# Altium project NG_0036526167_Diplomski-rad.PrjPcb
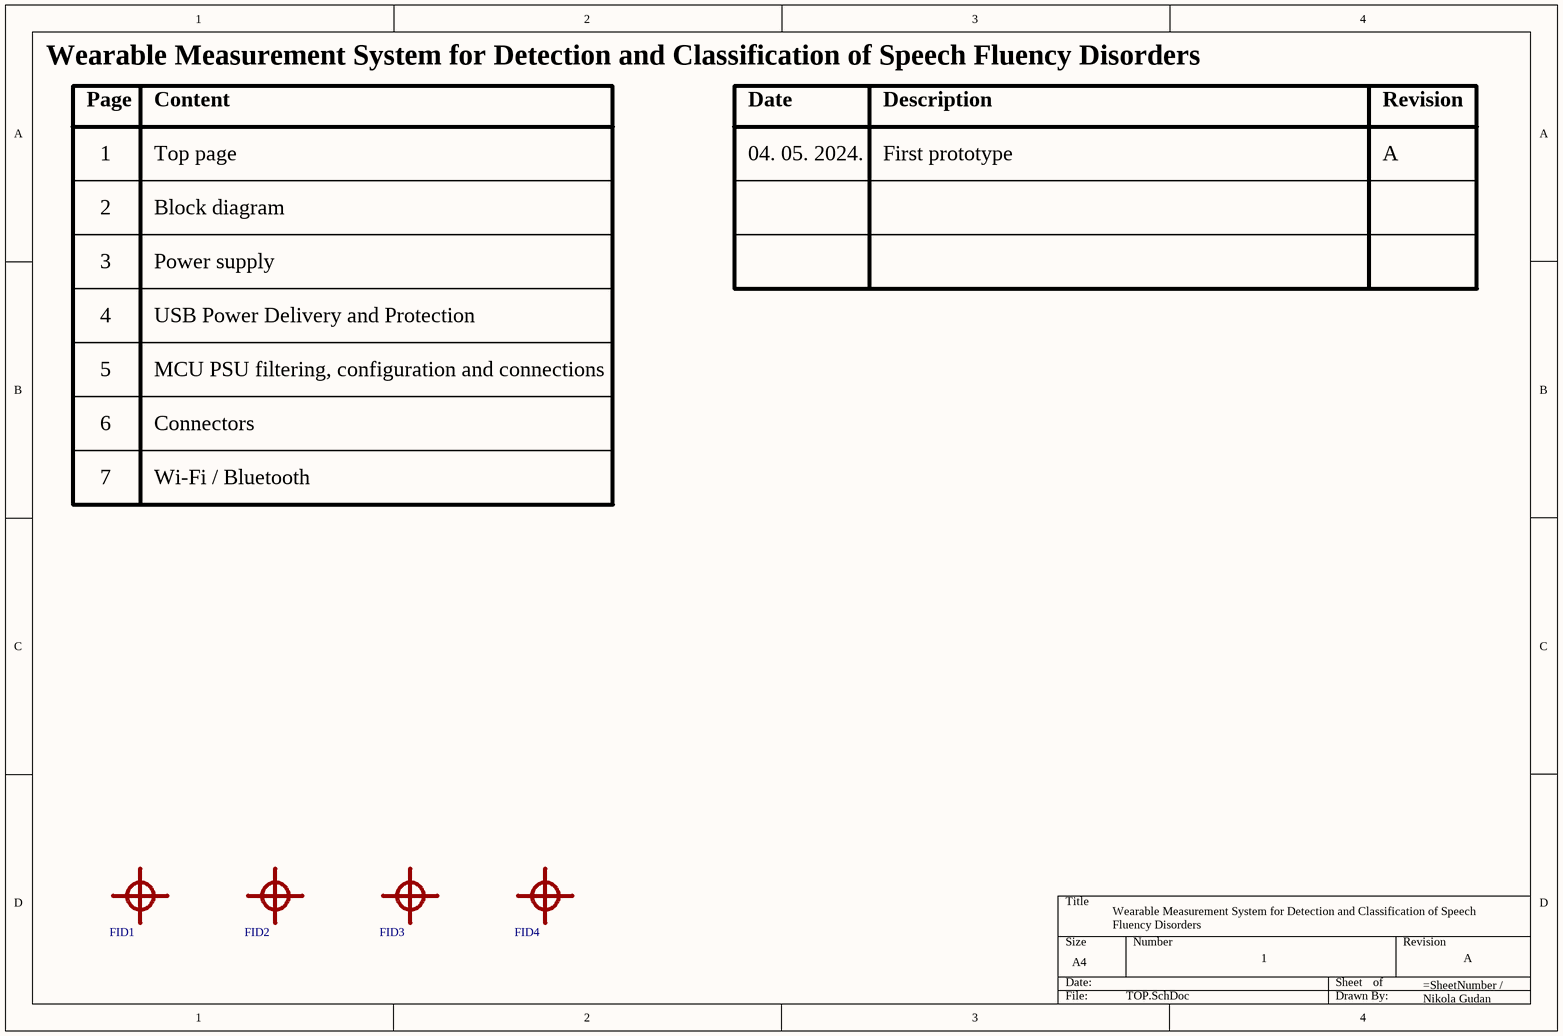
[diagram p0: TOP.SchDoc]
Engineer: Nikola Gudan; Revision: A; Title: Wearable Measurement System for Detection and Classification of Speech Fluency Disorders
7 sheets, 176 parts. Net scope: flat (ports and power ports of the same name join across sheets).
Board file: NG_0036526167_Diplomski-rad_PCB.PcbDoc
Sheets:
  TOP.SchDoc
  BLOCK-DIAGRAM.SchDoc
  POWER.SchDoc
  USB.SchDoc
  MCU.SchDoc
  CONN.SchDoc
  WIRELESS.SchDoc

## Sheet TOP.SchDoc: Wearable Measurement System for Detection and Classification of Speech Fluency Disorders
size A4; SheetNumber: 1; SheetTotal: 7

### Parts
FID1  FID  [FIDUCIAL]  (value not drawn)  (no BOM)
FID2  FID  [FIDUCIAL]  (value not drawn)  (no BOM)
FID3  FID  [FIDUCIAL]  (value not drawn)  (no BOM)
FID4  FID  [FIDUCIAL]  (value not drawn)  (no BOM)

### Notes on the sheet
- Page
- Content
- Date
- Description
- Revision
- 1
- Top page
- 04. 05. 2024.
- First prototype
- A
- 2
- Block diagram
- 3
- Power supply
- 4
- 5
- USB Power Delivery and Protection
- MCU PSU filtering, configuration and connections
- 6
- Connectors
- 7
- Wi-Fi / Bluetooth

### Library data of the parts
FID1-FID4 = FIDUCIAL: Fiducial marker; Checked: Yes; Footprint: ?; MFR: ?; Supplier: Digi-Key; SPN: ?; MFRN: ?

## Sheet BLOCK-DIAGRAM.SchDoc: Wearable Measurement System for Detection and Classification of Speech Fluency Disorders
size A4; SheetNumber: 2; SheetTotal: 7
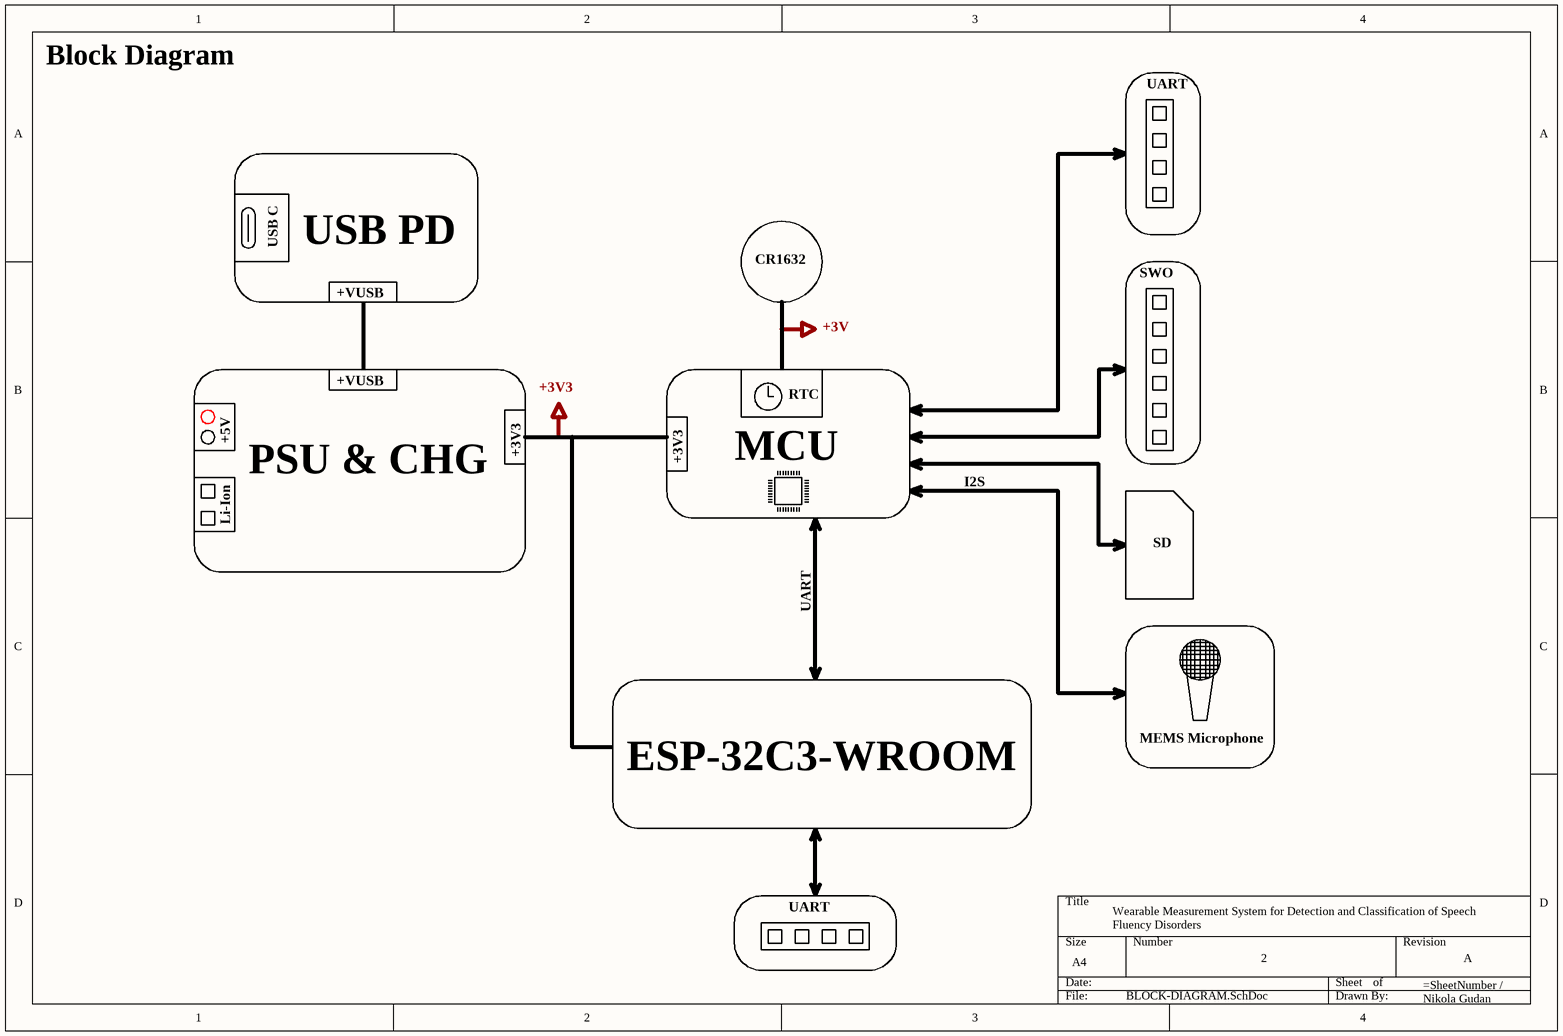
[diagram p1: BLOCK-DIAGRAM.SchDoc]

### Notes on the sheet
- Block Diagram
- UART
- USB C
- USB PD
- +VUSB
- CR1632
- SWO
- +3V
- +5V
- +3V3
- RTC
- Li-Ion
- PSU & CHG
- MCU
- I2S
- SD
- ESP-32C3-WROOM
- MEMS Microphone

## Sheet POWER.SchDoc: Wearable Measurement System for Detection and Classification of Speech Fluency Disorders
size A4; SheetNumber: 3; SheetTotal: 7
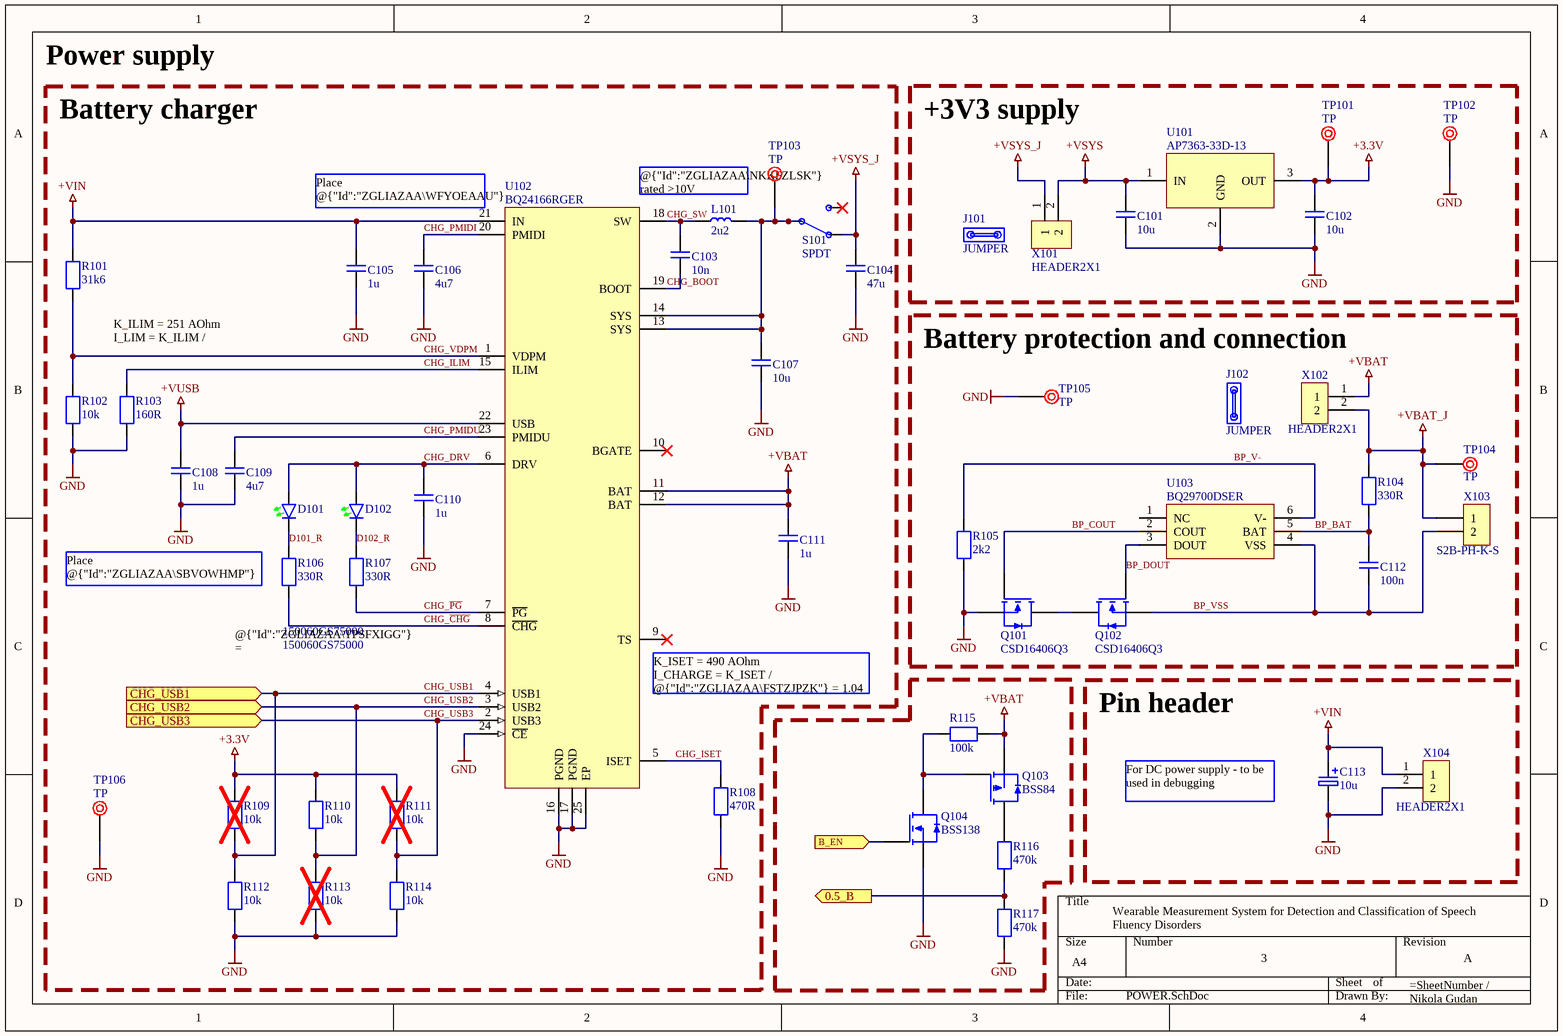
[diagram p2: POWER.SchDoc]

### Parts
C101  10u  [CAPC0603]
C102  10u  [CAPC0603]
C103  10n  [CAPC0603]
C104  47u  [CAPC0805]
C105  1u  [CAPC0603]
C106  4u7  [CAPC0603]
C107  10u  [CAPC0603]
C108  1u  [CAPC0603]
C109  4u7  [CAPC0603]
C110  1u  [CAPC0603]
C111  1u  [CAPC0603]
C112  100n  [CAPC0603]
C113  10u  [CAPCP1206]
D101  150060GS75000  [LED0603]
D102  150060GS75000  [LED0603]
J101  JUMPER  (mechanical)
J102  JUMPER  (mechanical)
L101  2u2  [INDM4145X18]
Q101  CSD16406Q3  [TRANS_CSD16406Q3]
Q102  CSD16406Q3  [TRANS_CSD16406Q3]
Q103  BSS84  [SOT190P240X290-3]
Q104  BSS138  [SOT190P240X290-3]
R101  31k6  [RESC0603]
R102  10k  [RESC0603]
R103  160R  [RESC0603]
R104  330R  [RESC0603]
R105  2k2  [RESC0603]
R106  330R  [RESC0603]
R107  330R  [RESC0603]
R108  470R  [RESC0603]
R109  10k  [RESC0603]
R110  10k  [RESC0603]
R111  10k  [RESC0603]
R112  10k  [RESC0603]
R113  10k  [RESC0603]
R114  10k  [RESC0603]
R115  100k  [RESC0603]
R116  470k  [RESC0603]
R117  470k  [RESC0603]
S101  SPDT  [SW_EG1247]
TP101  TP  [TESTPOINT]
TP102  TP  [TESTPOINT]
TP103  TP  [TESTPOINT]
TP104  TP  [TESTPOINT]
TP105  TP  [TESTPOINT]
TP106  TP  [TESTPOINT]
U101  AP7363-33D-13  [TO457X991X229-3]
U102  BQ24166RGER  [QFN50P410X410X100-24EP]
U103  BQ29700DSER  [WSON50P150X150X80-6]
X101  HEADER2X1  [HDRV2W64P254_2X1_508X254X1150]
X102  HEADER2X1  [HDRV2W64P254_2X1_508X254X1150]
X103  S2B-PH-K-S  [JST_S2B-PH-K-S]
X104  HEADER2X1  [HDRV2W64P254_2X1_508X254X1150]

### Blocks framed on the sheet
+3V3 supply: C101 C102 J101 TP101 TP102 U101 X101
Battery protection and connection: C112 J102 Q101 Q102 R104 R105 TP104 TP105 U103 X102 X103
Pin header: C113 X104

### Ports
0.5_B (out, see MCU[1B]), B_EN (in, see MCU[1B]), CHG_USB1 (in, see MCU[2B]), CHG_USB2 (in, see MCU[2B]), CHG_USB3 (in, see MCU[2B])

### Nets
+3.3V: C102.2 R109.1 R110.1 R111.1 TP101.1 U101.3(OUT)
+VBAT: C111.2 Q103.2(S) R115.1 U102.11(BAT) U102.12(BAT) X102.1
+VBAT_J: R104.2 TP104.1 X102.2 X103.1
+VIN: C105.2 C113.1 R101.2 U102.21(IN) X104.1
+VSYS: C101.2 U101.1(IN) X101.2
+VSYS_J: C104.2 S101.1 X101.1
+VUSB: C108.2 U102.22(USB)
GND: C101.1 C102.1 C104.1 C105.1 C106.1 C107.1 C108.1 C109.1 C110.1 C111.1 C113.2 Q101.1(S) Q104.2(S) R102.2 R103.2 R105.1 R108.1 R112.2 R113.2 R114.2 R117.2 TP102.1 TP105.1 TP106.1 U101.2(GND) U102.16(PGND) U102.17(PGND) U102.24(~{CE}) U102.25(EP) X104.2
0.5_B: R116.2 R117.1 ; port 0.5_B
B_EN: Q104.1(G) ; port B_EN
BP_BAT: C112.2 R104.1 U103.5(BAT)
BP_COUT: Q101.3(G) U103.2(COUT)
BP_DOUT: Q102.3(G) U103.3(DOUT)
BP_V-: R105.2 U103.6(V-)
BP_VSS: C112.1 Q102.1(S) U103.4(VSS) X103.2
CHG_BOOT: C103.1 U102.19(BOOT)
CHG_~{CHG}: R106.1 U102.8(~{CHG})
CHG_DRV: C110.2 D101.2 D102.2 U102.6(DRV)
CHG_ILIM: R103.1 U102.15(ILIM)
CHG_ISET: R108.2 U102.5(ISET)
CHG_~{PG}: R107.1 U102.7(~{PG})
CHG_PMIDI: C106.2 U102.20(PMIDI)
CHG_PMIDU: C109.2 U102.23(PMIDU)
CHG_SW: C103.2 L101.1 U102.18(SW)
CHG_USB1: R109.2 R112.1 U102.4(USB1) ; port CHG_USB1
CHG_USB2: R110.2 R113.1 U102.3(USB2) ; port CHG_USB2
CHG_USB3: R111.2 R114.1 U102.2(USB3) ; port CHG_USB3
CHG_VDPM: R101.1 R102.1 U102.1(VDPM)
D101_R: D101.1 R106.2
D102_R: D102.1 R107.2
NetC107_2: C107.2 L101.2 S101.2 TP103.1 U102.13(SYS) U102.14(SYS)
NetQ101_2: Q101.2(D) Q102.2(D)
NetQ103_1: Q103.1(G) Q104.3(D) R115.2
NetQ103_3: Q103.3(D) R116.1

Not connected (* = marked no-connect by the designer): S101 3*; U102 9(TS)* 10(BGATE)*; U103 1(NC)

### Notes on the sheet
- Power supply
- Battery charger
- (near U102) Place @{"Id":"ZGLIAZAA\WFYOEAAU"} and @{"Id":"ZGLIAZAA\EWRWHMYO"} as close as possible to charger IC
- @{"Id":"ZGLIAZAA\NKKFZLSK"} rated >10V
- K_ILIM = 251 AOhm
  I_LIM = K_ILIM / @{"Id":"ZGLIAZAA\ONCUCXZC"} = 1.57 A
- Place @{"Id":"ZGLIAZAA\SBVOWHMP"} and @{"Id":"ZGLIAZAA\CELJBMPW"} as close as possible to charger IC
- @{"Id":"ZGLIAZAA\TPSFXIGG"} =
  @{"Id":"ZGLIAZAA\WLQFVBKC"} =
- (near U102) K_ISET = 490 AOhm
  I_CHARGE = K_ISET / @{"Id":"ZGLIAZAA\FSTZJPZK"} = 1.04 A
- For DC power supply - to be used in debugging

### Library data of the parts
C101-C103 C105-C112 = CAPC0603: Ceramic capacitor, VAL?,  VOL?, DIEL?; Checked: Yes; MFR: ?; Supplier: Digi-Key; SPN: ?; MFRN: ?; LCSC Part Number: ?
  C101 C102 C107: Value: 10u
  C103: Value: 10n
  C105 C108 C110 C111: Value: 1u
  C106 C109: Value: 4u7
  C112: Value: 100n
C104 = CAPC0805: Ceramic capacitor, VAL?,  VOL?, DIEL?; Checked: Yes; Footprint: 0805; MFR: ?; Supplier: Mouser; SPN: ?; MFRN: ?; Value: 47u; LCSC Part Number: ?
C113 = CAPCP1206-10u-10: Tantalum capacitor, 10uF,  10V, 3.8Ohm; MFR: KEMET; MFRN: T491A106K010AT; SPN: 399-3684-2-ND; Checked: Yes; Supplier: Digi-Key; Value: 10u; LCSC Part Number: C1508940
D101 D102 = LTST-C194KGKT: LED Green, 2.1V, 20mA; MFR: Würth Elektronik; SPN: 732-4971-2-ND; Checked: Yes; Supplier: Digi-Key; MFRN: 150060GS75000; Value: Green; LCSC Part Number: C913102
J101 J102 = JUMPER: Open Top 3A 2.54mm P=2.54mm Shunts & Jumpers ROHS; MFR: Kycon, Inc.; MFRN: SX1100-A; SPN: 2092-SX1100-A-ND; Value: C5305; Checked: Yes; Supplier: Digi-Key; LCSC Part Number: C5305
L101 = INDM4145-2u2-20: Inductor 2.2uH, 4A, ±20%, 61mOhm; MFR: Bourns Inc.; MFRN: SRP4020TA-2R2M; SPN: SRP4020TA-2R2MTR-ND; Checked: Yes; Supplier: Digi-Key; Value: 2.2uH; LCSC Part Number: C2847469
Q101 Q102 = CSD16406Q3: MOSFET N-CH 25V 60A 8VSON; MFR: Texas Instruments; SPN: 296-24251-2-ND; Checked: Yes; Supplier: Digi-Key; MFRN: CSD16406Q3; Value: CSD16406Q3; LCSC Part Number: C2861720
Q103 = BSS84: MOSFET P-CH 50V 130mA SOT23-3; MFR: onsemi; SPN: BSS84TR-ND; Checked: Yes; Supplier: Digi-Key; MFRN: BSS84; Value: BSS84; LCSC Part Number: C266796
Q104 = BSS138: MOSFET N-CH 50V 220mA SOT23-3; MFR: onsemi; SPN: BSS138TR-ND; Checked: Yes; Supplier: Digi-Key; MFRN: BSS138; Value: BSS138; LCSC Part Number: C52895
R101-R117 = RES0603: Thick film resistor, VAL?, POW?; Checked: Yes; MFR: ?; Supplier: Digi-Key; SPN: ?; MFRN: ?; LCSC Part Number: ?
  R101: Value: 31k6
  R102 R109-R114: Value: 10k
  R103: Value: 160R
  R104 R106 R107: Value: 330R
  R105: Value: 2k2
  R108: Value: 470R
  R115: Value: 100k
  R116 R117: Value: 470k
S101 = SLIDE SW SPDT: Slide switch, SPDT, 30V, 200mA; MFR: E-Switch; MFRN: EG1247; SPN: EG1247-ND; Value: EG1247; Checked: Yes; Supplier: Digi-Key
TP101-TP106 = TESTPOINT: MFR: Keystone; MFRN: 5001; SPN: 36-5001-ND; Value: 5001; Checked: Yes; Supplier: Digi-Key; LCSC Part Number: C238122
U101 = IC REG LINEAR AP7363-33D-13: Linear LDO Voltage Regulator, 3.3V, 1.5A; MFR: Diodes Incorporated; SPN: AP7363-33D-13TR-ND; Checked: Yes; Supplier: Digi-Key; MFRN: AP7363-33D-13; Value: AP7363-33D-13; LCSC Part Number: C108723
U102 = IC BATT CHG LI-ION BQ24166: IC Battery Charger, Li-Ion, 1 Cell, 3.7V, 2.5A; MFR: Texas Instruments; SPN: 296-48490-2-ND; Checked: Yes; Supplier: Digi-Key; MFRN: BQ24166RGER; Value: BQ24166RGER; LCSC Part Number: C2758608
U103 = IC BATT PROT BQ29700DSER: Battery Protection IC Li-Ion 1Cell; MFR: Texas Instruments; SPN: 296-43985-2-ND; Checked: Yes; Supplier: Digi-Key; MFRN: BQ29700DSER; Value: BQ29700DSER; LCSC Part Number: C183096
X101 X102 = HEADER2X1: Pin Header 2x1, P2.54; MFR: Adam Tech; MFRN: PH1-02-UA; SPN: 2057-PH1-02-UA-ND; Value: X6521WV-2x01H-C60D30; Checked: Yes; Supplier: Digi-Key; LCSC Part Number: C2883961
X103 = JST S2B-PH-K-S: JST PH Connector 2POS R/A THT; MFR: JST Sales America Inc.; SPN: 455-1719-ND; Checked: Yes; Supplier: Digi-Key; MFRN: S2B-PH-K-S; Value: S2B-PH-K-S; LCSC Part Number: C173752
X104 = HEADER2X1: Pin Header 2x1, P2.54; MFR: Adam Tech; MFRN: PH1-02-UA; SPN: 2057-PH1-02-UA-ND; Checked: Yes; Supplier: Digi-Key; Value: HEADER2X1; LCSC Part Number: C2883961

## Sheet USB.SchDoc: Wearable Measurement System for Detection and Classification of Speech Fluency Disorders
size A4; SheetNumber: 4; SheetTotal: 7
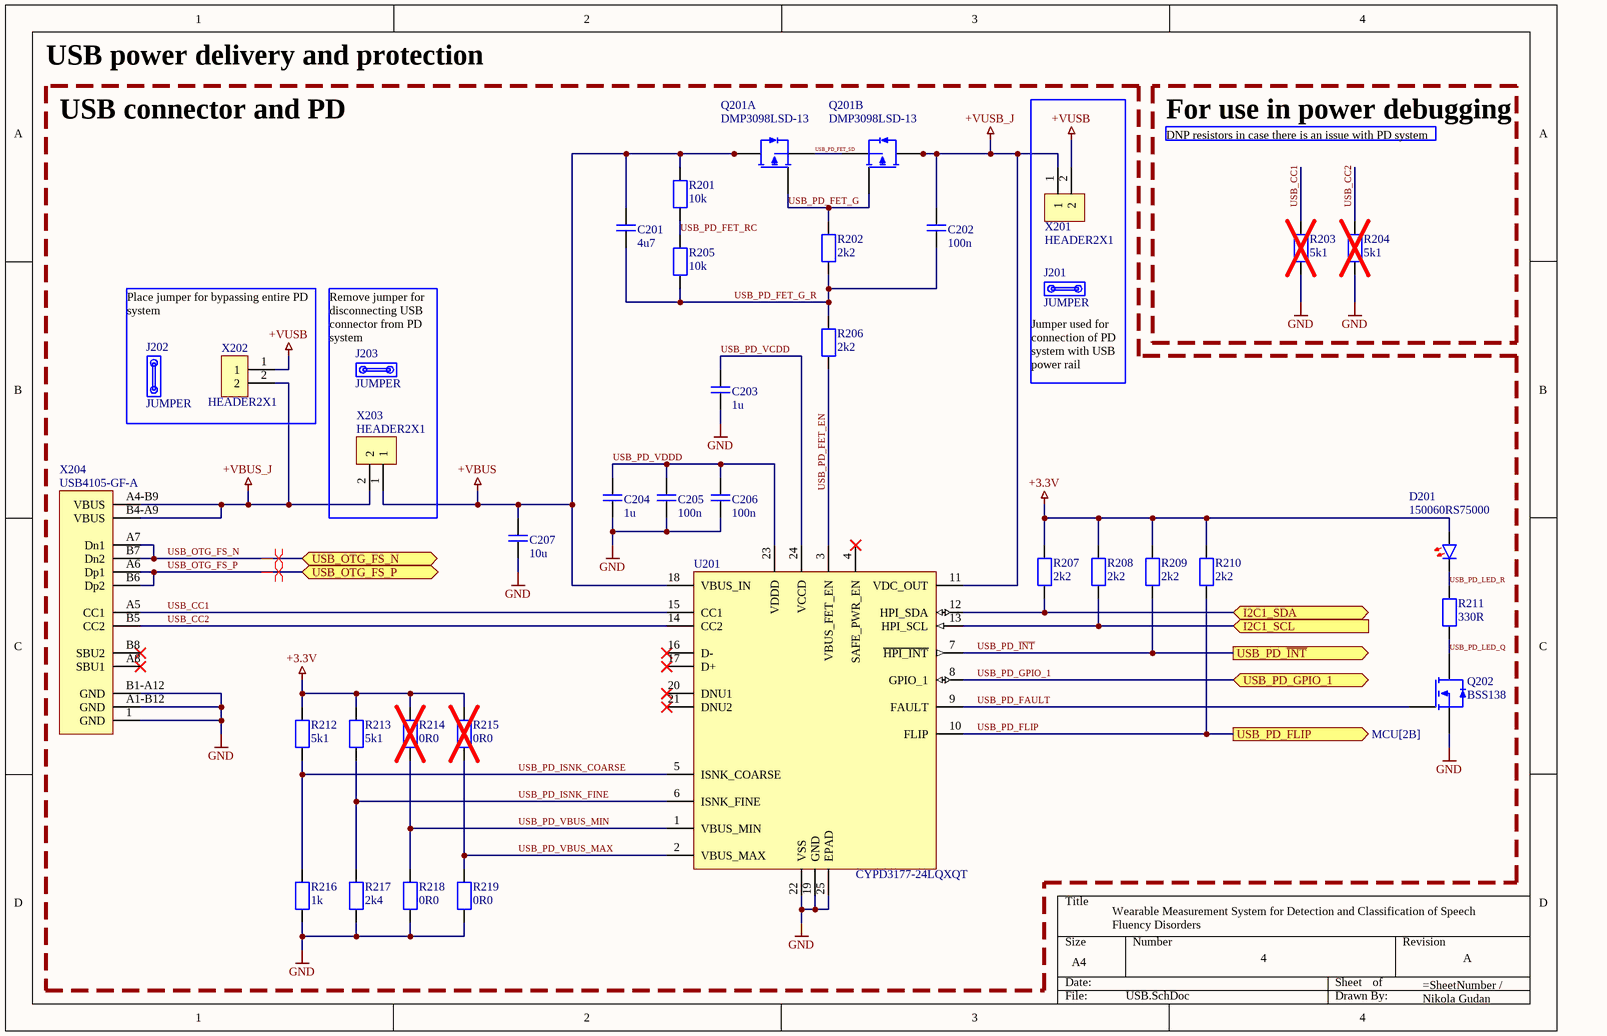
[diagram p3: USB.SchDoc]

### Parts
C201  4u7  [CAPC0603]
C202  100n  [CAPC0603]
C203  1u  [CAPC0603]
C204  1u  [CAPC0603]
C205  100n  [CAPC0603]
C206  100n  [CAPC0603]
C207  10u  [CAPC0603]
D201  150060RS75000  [LED0603]
J201  JUMPER  (mechanical)
J202  JUMPER  (mechanical)
J203  JUMPER  (mechanical)
Q201  DMP3098LSD-13  [SOIC127P620X175-8]  (parts A,B of 2)
Q202  BSS138  [SOT190P240X290-3]
R201  10k  [RESC0603]
R202  2k2  [RESC0603]
R203  5k1  [RESC0603]
R204  5k1  [RESC0603]
R205  10k  [RESC0603]
R206  2k2  [RESC0603]
R207  2k2  [RESC0603]
R208  2k2  [RESC0603]
R209  2k2  [RESC0603]
R210  2k2  [RESC0603]
R211  330R  [RESC0603]
R212  5k1  [RESC0603]
R213  5k1  [RESC0603]
R214  0R0  [RESC0603]
R215  0R0  [RESC0603]
R216  1k  [RESC0603]
R217  2k4  [RESC0603]
R218  0R0  [RESC0603]
R219  0R0  [RESC0603]
U201  CYPD3177-24LQXQT  [QFN50P410X410X100-24EP]
X201  HEADER2X1  [HDRV2W64P254_2X1_508X254X1150]
X202  HEADER2X1  [HDRV2W64P254_2X1_508X254X1150]
X203  HEADER2X1  [HDRV2W64P254_2X1_508X254X1150]
X204  USB4105-GF-A  [GCT_USB4105-GF-A]

### Blocks framed on the sheet
For use in power debugging: R203 R204

### Ports
I2C1_SCL (in, see MCU[1B]), I2C1_SDA (bidir, see MCU[1B]), USB_OTG_FS_N (bidir, see MCU[1B]), USB_OTG_FS_P (bidir, see MCU[1B]), USB_PD_FLIP (out, see MCU[2B]), USB_PD_GPIO_1 (bidir, see MCU[2B]), USB_PD_~{INT} (out, see MCU[2B])

### Nets
+3.3V: D201.2 R207.2 R208.2 R209.2 R210.2 R212.2 R213.2 R214.2 R215.2
+VBUS: C201.2 C207.2 Q201.7(D1) Q201.8(D1) R201.2 U201.18(VBUS_IN) X203.1
+VBUS_J: X202.2 X203.2 X204.A4-B9(VBUS) X204.B4-A9(VBUS)
+VUSB: X201.2 X202.1
+VUSB_J: C202.2 Q201.5(D2) Q201.6(D2) U201.11(VDC_OUT) X201.1
GND: C203.1 C204.1 C205.1 C206.1 C207.1 Q202.2(S) R203.1 R204.1 R216.1 R217.1 R218.1 R219.1 U201.19(GND) U201.22(VSS) U201.25(EPAD) X204.1(GND) X204.A1-B12(GND) X204.B1-A12(GND)
I2C1_SCL: R208.1 U201.13(HPI_SCL) ; port I2C1_SCL
I2C1_SDA: R207.1 U201.12(HPI_SDA) ; port I2C1_SDA
USB_CC1: R203.2 U201.15(CC1) X204.A5(CC1)
USB_CC2: R204.2 U201.14(CC2) X204.B5(CC2)
USB_OTG_FS_N: X204.A7(Dn1) X204.B7(Dn2) ; port USB_OTG_FS_N
USB_OTG_FS_P: X204.A6(Dp1) X204.B6(Dp2) ; port USB_OTG_FS_P
USB_PD_FAULT: Q202.1(G) U201.9(FAULT)
USB_PD_FET_EN: R206.1 U201.3(VBUS_FET_EN)
USB_PD_FET_G: Q201.2(G1) Q201.4(G2) R202.2
USB_PD_FET_G_R: C201.1 C202.1 R202.1 R205.1 R206.2
USB_PD_FET_RC: R201.1 R205.2
USB_PD_FET_SD: Q201.1(S1) Q201.3(S2)
USB_PD_FLIP: R210.1 U201.10(FLIP) ; port USB_PD_FLIP
USB_PD_GPIO_1: U201.8(GPIO_1) ; port USB_PD_GPIO_1
USB_PD_~{INT}: R209.1 U201.7(~{HPI_INT}) ; port USB_PD_~{INT}
USB_PD_ISNK_COARSE: R212.1 R216.2 U201.5(ISNK_COARSE)
USB_PD_ISNK_FINE: R213.1 R217.2 U201.6(ISNK_FINE)
USB_PD_LED_Q: Q202.3(D) R211.1
USB_PD_LED_R: D201.1 R211.2
USB_PD_VBUS_MAX: R215.1 R219.2 U201.2(VBUS_MAX)
USB_PD_VBUS_MIN: R214.1 R218.2 U201.1(VBUS_MIN)
USB_PD_VCDD: C203.2 U201.24(VCCD)
USB_PD_VDDD: C204.2 C205.2 C206.2 U201.23(VDDD)

Not connected (* = marked no-connect by the designer): U201 4(SAFE_PWR_EN)* 16(D-)* 17(D+)* 20(DNU1)* 21(DNU2)*; X204 A8(SBU1)* B8(SBU2)*

### Layout directives
differential pair: USB_OTG_FS_N, USB_OTG_FS_P

### Notes on the sheet
- USB power delivery and protection
- USB connector and PD
- DNP resistors in case there is an issue with PD system
- Jumper used for connection of PD system with USB power rail
- Place jumper for bypassing entire PD system
- Remove jumper for disconnecting USB connector from PD system

### Library data of the parts
C201-C207 = CAPC0603: as C101 on sheet POWER; MFR: ?; Supplier: Digi-Key; SPN: ?; MFRN: ?; LCSC Part Number: ?
  C201: Value: 4u7
  C202 C205 C206: Value: 100n
  C203 C204: Value: 1u
  C207: Value: 10u
D201 = HL-PST-1608S9AC-04: LED Red, 2.3V, 20mA; MFR: Würth Elektronik; SPN: 732-4978-2-ND; Checked: Yes; Supplier: Digi-Key; MFRN: 150060RS75000; Value: RED; LCSC Part Number: C497931
J201-J203 = JUMPER: as J101 on sheet POWER; Supplier: Digi-Key; LCSC Part Number: C5305
Q201 = DMP3098LSD-13: MOSFET 2P-CH 30V 4.4A 8-SOIC; MFR: Diodes Incorporated; SPN: DMP3098LSD-13DITR-ND; Checked: Yes; Supplier: Digi-Key; MFRN: DMP3098LSD-13; Value: DMP3098LSD-13; LCSC Part Number: C531177
Q202 = BSS138: MOSFET N-CH 50V 220MA SOT23-3; MFR: onsemi; SPN: BSS138TR-ND; Checked: Yes; Supplier: Digi-Key; MFRN: BSS138; Value: BSS138; LCSC Part Number: C52895
R201-R219 = RES0603: as R101 on sheet POWER; MFR: ?; Supplier: Digi-Key; SPN: ?; MFRN: ?; LCSC Part Number: ?
  R201 R205: Value: 10k
  R202 R206-R210: Value: 2k2
  R203 R204 R212 R213: Value: 5k1
  R211: Value: 330R
  R214 R215 R218 R219: Value: 0R0
  R216: Value: 1k
  R217: Value: 2k4
U201 = CYPD3177-24LQXQT: Generic Description; MFR: Infineon Technologies; SPN: 448-CYPD3177-24LQXQTTR-ND; Checked: Yes; Supplier: Digi-Key; MFRN: CYPD3177-24LQXQT; Value: CYPD3177-24LQXQT; LCSC Part Number: C5904158
X201 X202 = HEADER2X1: as X101 on sheet POWER; Supplier: Digi-Key; LCSC Part Number: C2883961
X203 = HEADER2X1: as X104 on sheet POWER; Supplier: Digi-Key; Value: HEADER2X1; LCSC Part Number: C2883961
X204 = CONN USB 2.0 TYPE C: USB TYPE-C 3.1, 3A; MFR: GCT; SPN: 2073-USB4105-GF-ATR-ND; Checked: Yes; Supplier: Digi-Key; MFRN: USB4105-GF-A; Value: USB4105-GF-A; LCSC Part Number: C2997433

## Sheet MCU.SchDoc: Wearable Measurement System for Detection and Classification of Speech Fluency Disorders
size A4; SheetNumber: 5; SheetTotal: 7
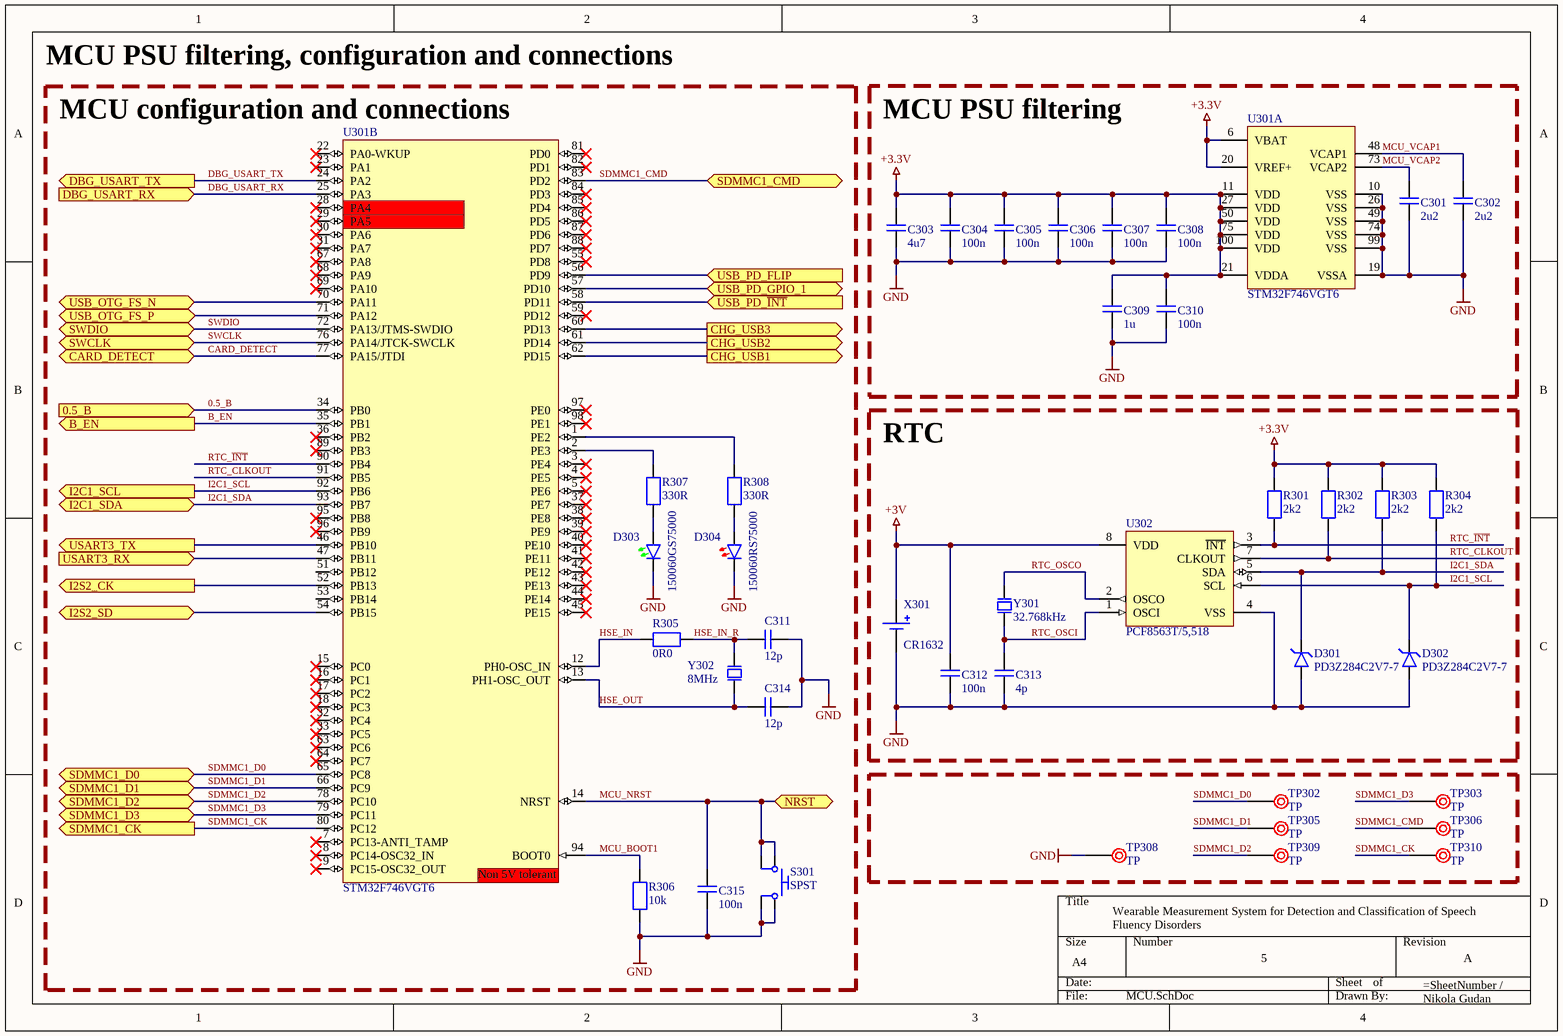
[diagram p4: MCU.SchDoc]

### Parts
C301  2u2  [CAPC0603]
C302  2u2  [CAPC0603]
C303  4u7  [CAPC0603]
C304  100n  [CAPC0603]
C305  100n  [CAPC0603]
C306  100n  [CAPC0603]
C307  100n  [CAPC0603]
C308  100n  [CAPC0603]
C309  1u  [CAPC0603]
C310  100n  [CAPC0603]
C311  12p  [CAPC0603]
C312  100n  [CAPC0603]
C313  4p  [CAPC0603]
C314  12p  [CAPC0603]
C315  100n  [CAPC0603]
D301  PD3Z284C2V7-7  [PowerDI323]
D302  PD3Z284C2V7-7  [PowerDI323]
D303  150060GS75000  [LED0603]
D304  150060RS75000  [LED0603]
R301  2k2  [RESC0603]
R302  2k2  [RESC0603]
R303  2k2  [RESC0603]
R304  2k2  [RESC0603]
R305  0R0  [RESC0603]
R306  10k  [RESC0603]
R307  330R  [RESC0603]
R308  330R  [RESC0603]
S301  SPST  [SW_TSA063G60-250]
TP302  TP  [TESTPOINT]
TP303  TP  [TESTPOINT]
TP305  TP  [TESTPOINT]
TP306  TP  [TESTPOINT]
TP308  TP  [TESTPOINT]
TP309  TP  [TESTPOINT]
TP310  TP  [TESTPOINT]
U301  STM32F746VGT6  [QFP50P1600X1600X160-100]  (parts A,B of 2)
U302  PCF8563T/5,518  [SOIC127P610X175-8]
X301  CR1632  [BAT_504TR]
Y301  32.768kHz  [XTAL320X150X80]
Y302  8MHz  [XTAL800X450X180]

### Blocks framed on the sheet
MCU PSU filtering: C301-C310 U301
RTC: C312 C313 D301 D302 R301-R304 U302 X301 Y301

### Ports
0.5_B (in, see POWER[3D]), B_EN (out, see POWER[3D]), CARD_DETECT (bidir, see CONN[3B]), CHG_USB1 (out, see POWER[1C]), CHG_USB2 (out, see POWER[1C]), CHG_USB3 (out, see POWER[1C]), DBG_USART_RX (in, see CONN[4B]), DBG_USART_TX (out, see CONN[4B]), I2C1_SCL (out, see USB[4C]), I2C1_SDA (bidir, see USB[4C]), I2S2_CK (out, see CONN[1C]), I2S2_SD (bidir, see CONN[1C]), NRST (bidir, see CONN[4A], WIRELESS[1B]), SDMMC1_CK (out, see CONN[3B]), SDMMC1_CMD (bidir, see CONN[3B]), SDMMC1_D0 (bidir, see CONN[3B]), SDMMC1_D1 (bidir, see CONN[3B]), SDMMC1_D2 (bidir, see CONN[3B]), SDMMC1_D3 (bidir, see CONN[3B]), SWCLK (bidir, see CONN[4A]), SWDIO (bidir, see CONN[4A]), USART3_RX (in, see WIRELESS[2B]), USART3_TX (out, see WIRELESS[2B]), USB_OTG_FS_N (bidir, see USB[1C]), USB_OTG_FS_P (bidir, see USB[1C]), USB_PD_FLIP (in, see USB[4C]), USB_PD_GPIO_1 (bidir, see USB[4C]), USB_PD_~{INT} (in, see USB[4C])

### Nets
+3.3V: C303.2 C304.2 C305.2 C306.2 C307.2 C308.2 C309.2 C310.2 R301.2 R302.2 R303.2 R304.2 U301.6(VBAT) U301.11(VDD) U301.20(VREF+) U301.21(VDDA) U301.27(VDD) U301.50(VDD) U301.75(VDD) U301.100(VDD)
+3V: C312.2 U302.8(VDD) X301.1(P)
GND: C301.1 C302.1 C303.1 C304.1 C305.1 C306.1 C307.1 C308.1 C309.1 C310.1 C311.2 C312.1 C313.1 C314.2 C315.1 D301.2 D302.2 D303.1 D304.1 R306.1 S301.3 S301.4 TP308.1 U301.10(VSS) U301.19(VSSA) U301.26(VSS) U301.49(VSS) U301.74(VSS) U301.99(VSS) U302.4(VSS) X301.2(N)
0.5_B: U301.34(PB0) ; port 0.5_B
B_EN: U301.35(PB1) ; port B_EN
CARD_DETECT: U301.77(PA15/JTDI) ; port CARD_DETECT
CHG_USB1: U301.62(PD15) ; port CHG_USB1
CHG_USB2: U301.61(PD14) ; port CHG_USB2
CHG_USB3: U301.60(PD13) ; port CHG_USB3
DBG_USART_RX: U301.25(PA3) ; port DBG_USART_RX
DBG_USART_TX: U301.24(PA2) ; port DBG_USART_TX
HSE_IN: R305.2 U301.12(PH0-OSC_IN)
HSE_IN_R: C311.1 R305.1 Y302.2
HSE_OUT: C314.1 U301.13(PH1-OSC_OUT) Y302.1
I2C1_SCL: D302.1 R304.1 U301.92(PB6) U302.6(SCL) ; port I2C1_SCL
I2C1_SDA: D301.1 R303.1 U301.93(PB7) U302.5(SDA) ; port I2C1_SDA
I2S2_CK: U301.52(PB13) ; port I2S2_CK
I2S2_SD: U301.54(PB15) ; port I2S2_SD
MCU_BOOT1: R306.2 U301.94(BOOT0)
MCU_NRST: C315.2 S301.1 S301.2 U301.14(NRST) ; port NRST
MCU_VCAP1: C302.2 U301.48(VCAP1)
MCU_VCAP2: C301.2 U301.73(VCAP2)
RTC_CLKOUT: R302.1 U301.91(PB5) U302.7(CLKOUT)
RTC_~{INT}: R301.1 U301.90(PB4) U302.3(~{INT})
RTC_OSCI: C313.2 U302.1(OSCI) Y301.1
RTC_OSCO: U302.2(OSCO) Y301.2
SDMMC1_CK: TP310.1 U301.80(PC12) ; port SDMMC1_CK
SDMMC1_CMD: TP306.1 U301.83(PD2) ; port SDMMC1_CMD
SDMMC1_D0: TP302.1 U301.65(PC8) ; port SDMMC1_D0
SDMMC1_D1: TP305.1 U301.66(PC9) ; port SDMMC1_D1
SDMMC1_D2: TP309.1 U301.78(PC10) ; port SDMMC1_D2
SDMMC1_D3: TP303.1 U301.79(PC11) ; port SDMMC1_D3
SWCLK: U301.76(PA14/JTCK-SWCLK) ; port SWCLK
SWDIO: U301.72(PA13/JTMS-SWDIO) ; port SWDIO
USART3_RX: U301.47(PB11) ; port USART3_RX
USART3_TX: U301.46(PB10) ; port USART3_TX
USB_OTG_FS_N: U301.70(PA11) ; port USB_OTG_FS_N
USB_OTG_FS_P: U301.71(PA12) ; port USB_OTG_FS_P
USB_PD_FLIP: U301.56(PD9) ; port USB_PD_FLIP
USB_PD_GPIO_1: U301.57(PD10) ; port USB_PD_GPIO_1
USB_PD_~{INT}: U301.58(PD11) ; port USB_PD_~{INT}
NetD303_2: D303.2 R307.1
NetD304_2: D304.2 R308.1
NetR307_2: R307.2 U301.2(PE3)
NetR308_2: R308.2 U301.1(PE2)

Not connected (* = marked no-connect by the designer): U301 3(PE4)* 4(PE5)* 5(PE6)* 7(PC13-ANTI_TAMP)* 8(PC14-OSC32_IN)* 9(PC15-OSC32_OUT)* 15(PC0)* 16(PC1)* 17(PC2)* 18(PC3)* 22(PA0-WKUP)* 23(PA1)* 28(PA4)* 29(PA5)* 30(PA6)* 31(PA7)* 32(PC4)* 33(PC5)* 36(PB2)* 37(PE7)* 38(PE8)* 39(PE9)* 40(PE10)* 41(PE11)* 42(PE12)* 43(PE13)* 44(PE14)* 45(PE15)* 51(PB12) 53(PB14) 55(PD8)* 59(PD12)* 63(PC6)* 64(PC7)* 67(PA8)* 68(PA9)* 69(PA10)* 81(PD0)* 82(PD1)* 84(PD3)* 85(PD4)* 86(PD5)* 87(PD6)* 88(PD7)* 89(PB3)* 95(PB8)* 96(PB9)* 97(PE0)* 98(PE1)*

### Notes on the sheet
- MCU PSU filtering, configuration and connections
- (near U301) MCU configuration and connections
- (in symbol STM32F746VGT6, part B) Non 5V tolerant

### Library data of the parts
C301-C315 = CAPC0603: as C101 on sheet POWER; MFR: ?; Supplier: Digi-Key; SPN: ?; MFRN: ?; LCSC Part Number: ?
  C301 C302: Value: 2u2
  C303: Value: 4u7
  C304-C308 C310 C312 C315: Value: 100n
  C309: Value: 1u
  C311 C314: Footprint: 0603; Value: 12p
  C313: Footprint: 0603; Value: 4p
D301 D302 = PD3Z284C2V7-7: Zener Dioode, 2.7V, 500mW; MFR: Diodes Incorporated; SPN: PD3Z284C2V7DITR-ND; Checked: Yes; Supplier: Digi-Key; MFRN: PD3Z284C2V7-7; Value: PD3Z284C2V7-7; LCSC Part Number: C531171
D303 = LTST-C194KGKT: as D101 on sheet POWER; Supplier: Digi-Key; MFRN: 150060GS75000; Value: Green; LCSC Part Number: C913102
D304 = HL-PST-1608S9AC-04: as D201 on sheet USB; Supplier: Digi-Key; MFRN: 150060RS75000; Value: RED; LCSC Part Number: C497931
R301-R308 = RES0603: as R101 on sheet POWER; MFR: ?; Supplier: Digi-Key; SPN: ?; MFRN: ?; LCSC Part Number: ?
  R301-R304: Value: 2k2
  R305: Value: 0R0
  R306: Value: 10k
  R307 R308: Value: 330R
S301 = TACT SW: TACT SW, SPST, NO; MFR: C&K; MFRN: PTS 647 SN50 SMTR2 LFS; SPN: PTS647SN50SMTR2LFSTR-ND; Value: PTS 647 SN50 SMTR2 LFS; Checked: Yes; Supplier: Digi-Key; LCSC Part Number: C294566
TP302 TP303 TP305 TP306 TP308-TP310 = TESTPOINT: as TP101 on sheet POWER; Supplier: Digi-Key; LCSC Part Number: C238122
U301 = STM32F746VGT6: High-performance and DSP with FPU, Arm Cortex-M7 MCU with 1 Mbyte of Flash memory, 216 MHz CPU, Art Accelerator, L1 cache, SDRAM, TFT; MFR: STMicroelectronics; SPN: 497-15819-ND; Checked: Yes; Supplier: Digi-Key; MFRN: STM32F746VGT6; Value: STM32F746VGT6; LCSC Part Number: C87664
U302 = PCF8563T/5,518: IC RTC CLOCK/CALENDAR I2C 8SO; MFR: NXP USA Inc.; SPN: 568-6650-2-ND; Checked: Yes; Supplier: Digi-Key; MFRN: PCF8563T/5,518; Value: PCF8563T/5,518; LCSC Part Number: C7440
X301 = CR1632: CR1632 Battery Holder; MFR: Keystone Electronics; MFRN: 504TR; SPN: 36-504TR-ND; Value: 504TR; Checked: Yes; Supplier: Digi-Key; LCSC Part Number: C964735
Y301 = X1A0001410002: Crystal, 32.768Hz, 9pF, 50kOhms; MFR: Seiko Epson; SPN: SER4072TR-ND; Checked: Yes; Supplier: Digi-Key; MFRN: X1A0001410002; Value: 32.768kHz; LCSC Part Number: C1987155
Y302 = NX8045GB-8.000000MHZ: Crystal, 8MHz, 8pF, 200Ohms; MFR: NDK; SPN: 644-LNCF001-8MTR-ND; Checked: Yes; Supplier: Digi-Key; MFRN: NX8045GB-8.000000MHZ; Value: 8MHz; LCSC Part Number: C1985641

## Sheet CONN.SchDoc: Wearable Measurement System for Detection and Classification of Speech Fluency Disorders
size A4; SheetNumber: 6; SheetTotal: 7
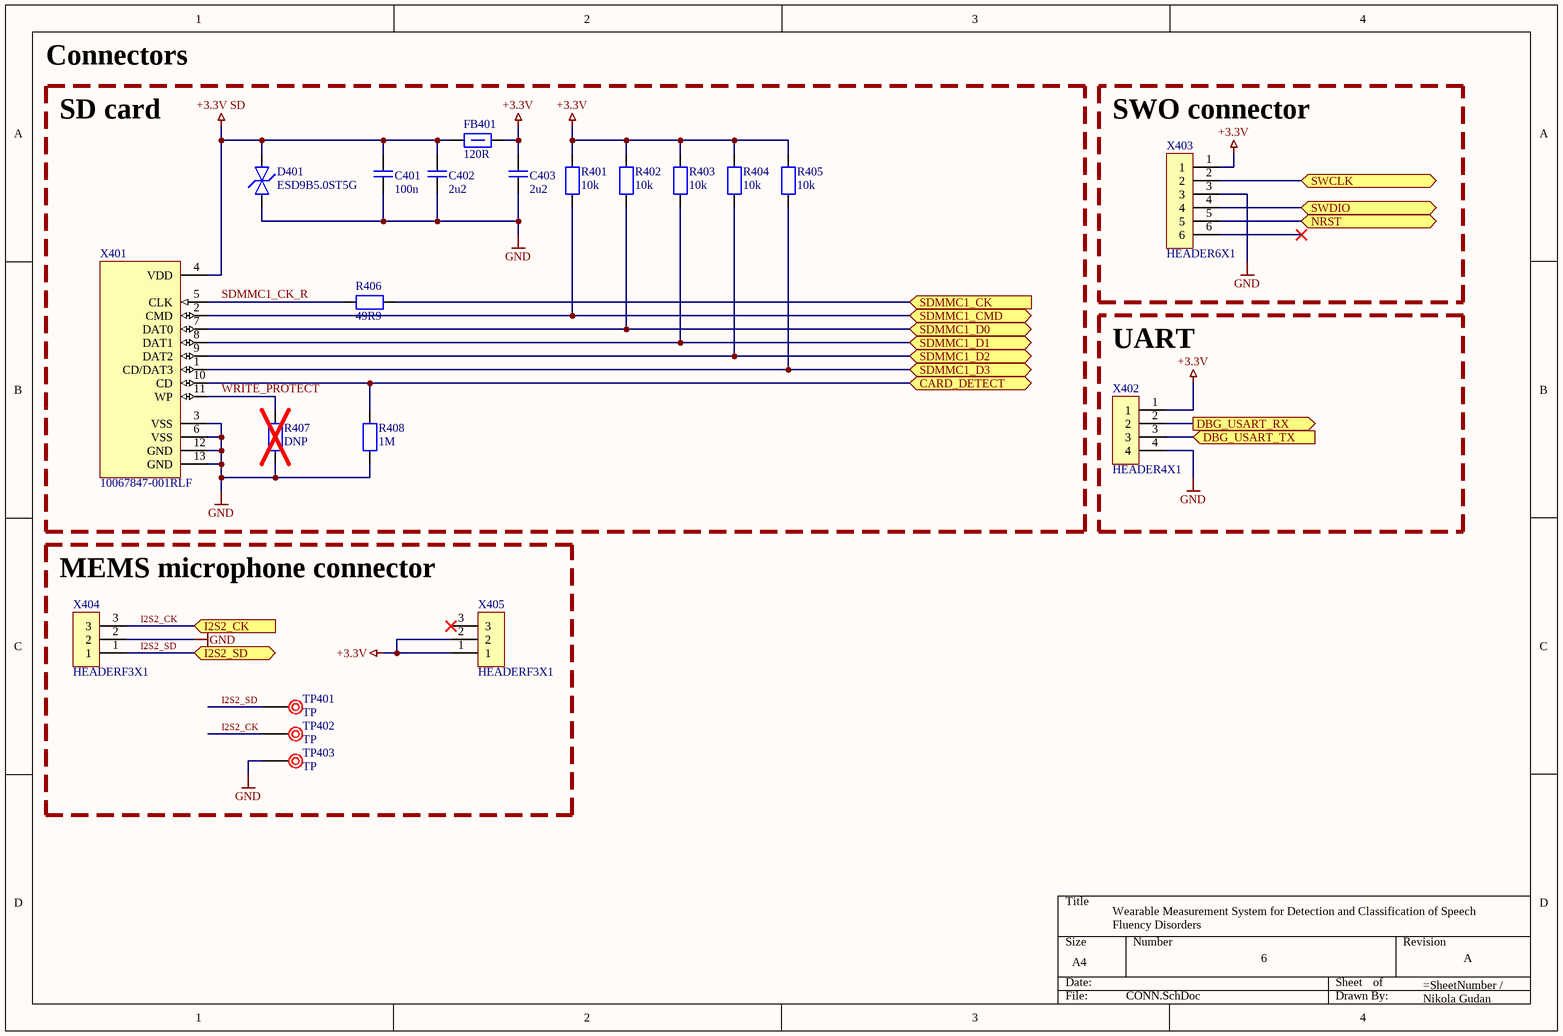
[diagram p5: CONN.SchDoc]

### Parts
C401  100n  [CAPC0603]
C402  2u2  [CAPC0603]
C403  2u2  [CAPC0603]
D401  ESD9B5.0ST5G  [DIOC8060X37]
FB401  120R  [FBC0603]
R401  10k  [RESC0603]
R402  10k  [RESC0603]
R403  10k  [RESC0603]
R404  10k  [RESC0603]
R405  10k  [RESC0603]
R406  49R9  [RESC0603]
R407  DNP  [RESC0603]
R408  1M  [RESC0603]
TP401  TP  [TESTPOINT]
TP402  TP  [TESTPOINT]
TP403  TP  [TESTPOINT]
X401  10067847-001RLF  [SD_10067847-001RLF]
X402  HEADER4X1  [HDRV4W64P254_4X1_1016X254X1150]
X403  HEADER6X1  [HDR6W64P254_6X1_1524X254X1150]
X404  HEADERF3X1  [HDRVF3W64P254_1X3_813X254X850P]
X405  HEADERF3X1  [HDRVF3W64P254_1X3_813X254X850P]

### Blocks framed on the sheet
SWO connector: X403
UART: X402
MEMS microphone connector: TP401-TP403 X404 X405

### Ports
CARD_DETECT (bidir, see MCU[1B]), DBG_USART_RX (out, see MCU[1A]), DBG_USART_TX (in, see MCU[1A]), I2S2_CK (in, see MCU[1C]), I2S2_SD (bidir, see MCU[1C]), NRST (bidir, see MCU[2D], WIRELESS[1B]), SDMMC1_CK (in, see MCU[1D]), SDMMC1_CMD (bidir, see MCU[2A]), SDMMC1_D0 (bidir, see MCU[1D]), SDMMC1_D1 (bidir, see MCU[1D]), SDMMC1_D2 (bidir, see MCU[1D]), SDMMC1_D3 (bidir, see MCU[1D]), SWCLK (bidir, see MCU[1B]), SWDIO (bidir, see MCU[1B])

### Nets
+3.3V: C403.2 FB401.2 R401.2 R402.2 R403.2 R404.2 R405.2 X402.1 X403.1 X405.1 X405.2
+3.3V SD: C401.2 C402.2 D401.2 FB401.1 X401.4(VDD)
GND: C401.1 C402.1 C403.1 D401.1 R407.1 R408.1 TP403.1 X401.3(VSS) X401.6(VSS) X401.12(GND) X401.13(GND) X402.4 X403.3 X404.2
CARD_DETECT: R408.2 X401.10(CD) ; port CARD_DETECT
DBG_USART_RX: X402.2 ; port DBG_USART_RX
DBG_USART_TX: X402.3 ; port DBG_USART_TX
I2S2_CK: TP402.1 X404.3 ; port I2S2_CK
I2S2_SD: TP401.1 X404.1 ; port I2S2_SD
MCU_NRST: X403.5 ; port NRST
SDMMC1_CK: R406.1 ; port SDMMC1_CK
SDMMC1_CK_R: R406.2 X401.5(CLK)
SDMMC1_CMD: R401.1 X401.2(CMD) ; port SDMMC1_CMD
SDMMC1_D0: R402.1 X401.7(DAT0) ; port SDMMC1_D0
SDMMC1_D1: R403.1 X401.8(DAT1) ; port SDMMC1_D1
SDMMC1_D2: R404.1 X401.9(DAT2) ; port SDMMC1_D2
SDMMC1_D3: R405.1 X401.1(CD/DAT3) ; port SDMMC1_D3
SWCLK: X403.2 ; port SWCLK
SWDIO: X403.4 ; port SWDIO
WRITE_PROTECT: R407.2 X401.11(WP)

Not connected (* = marked no-connect by the designer): X403 6*; X405 3*

### Notes on the sheet
- Connectors
- SD card

### Library data of the parts
C401-C403 = CAPC0603: as C101 on sheet POWER; MFR: ?; Supplier: Digi-Key; SPN: ?; MFRN: ?; LCSC Part Number: ?
  C401: Value: 100n
  C402 C403: Value: 2u2
D401 = TVS DIODE ESD9B5.0ST5G: TVS ZENER DIODE 5VWM; MFR: onsemi; SPN: ESD9B5.0ST5GOSTR-ND; Checked: Yes; Supplier: Digi-Key; MFRN: ESD9B5.0ST5G; Value: ESD9B5.0ST5G; LCSC Part Number: C3021104
FB401 = FB0603-120R: Ferrite bead, 120R@100MHz; MFR: TDK Corporation; MFRN: MMZ1608D121CTDH5; SPN: 445-MMZ1608D121CTDH5TR-ND; Checked: Yes; Supplier: Digi-Key; Value: 120R; LCSC Part Number: C3716437
R401-R408 = RES0603: as R101 on sheet POWER; MFR: ?; Supplier: Digi-Key; SPN: ?; MFRN: ?; LCSC Part Number: ?
  R401-R405: Value: 10k
  R406: Value: 49R9
  R407: Value: DNP
  R408: Value: 1M
TP401-TP403 = TESTPOINT: as TP101 on sheet POWER; Supplier: Digi-Key; LCSC Part Number: C238122
X401 = CONN SD CARD 10067847-001RLF: SD card connector, push-push, SMD; MFR: Amphenol ICC (FCI); SPN: 609-3956-2-ND; Checked: Yes; Supplier: Digi-Key; MFRN: 10067847-001RLF; Value: 10067847-001RLF; LCSC Part Number: C569097
X402 = HEADER4X1: Pin Header 4x1, P2.54; MFR: Würth Elektronik; MFRN: 61300411121; SPN: 732-5317-ND; Checked: Yes; Supplier: Digi-Key; Value: HEADER4X1
X403 = HEADER6X1: Pin header, 6x1, 100mil pitch; MFR: Adam Tech; MFRN: PH1-06-UA; SPN: 2057-PH1-06-UA-ND; Checked: Yes; Footprint: HEADER6X1; Supplier: Digi-Key; Value: HEADER6X1; LCSC Part Number: C2935912
X404 X405 = HEADERF3X1: Pin Header Female 3x1, P2.54; MFR: Sullins Connector Solutions; MFRN: PPTC031LFBN-RC; SPN: S7001-ND; Checked: Yes; Footprint: HEADERF3X1; Supplier: Digi-Key; Value: HEADERF3X1; LCSC Part Number: *

## Sheet WIRELESS.SchDoc: Wearable Measurement System for Detection and Classification of Speech Fluency Disorders
size A4; SheetNumber: 7; SheetTotal: 7
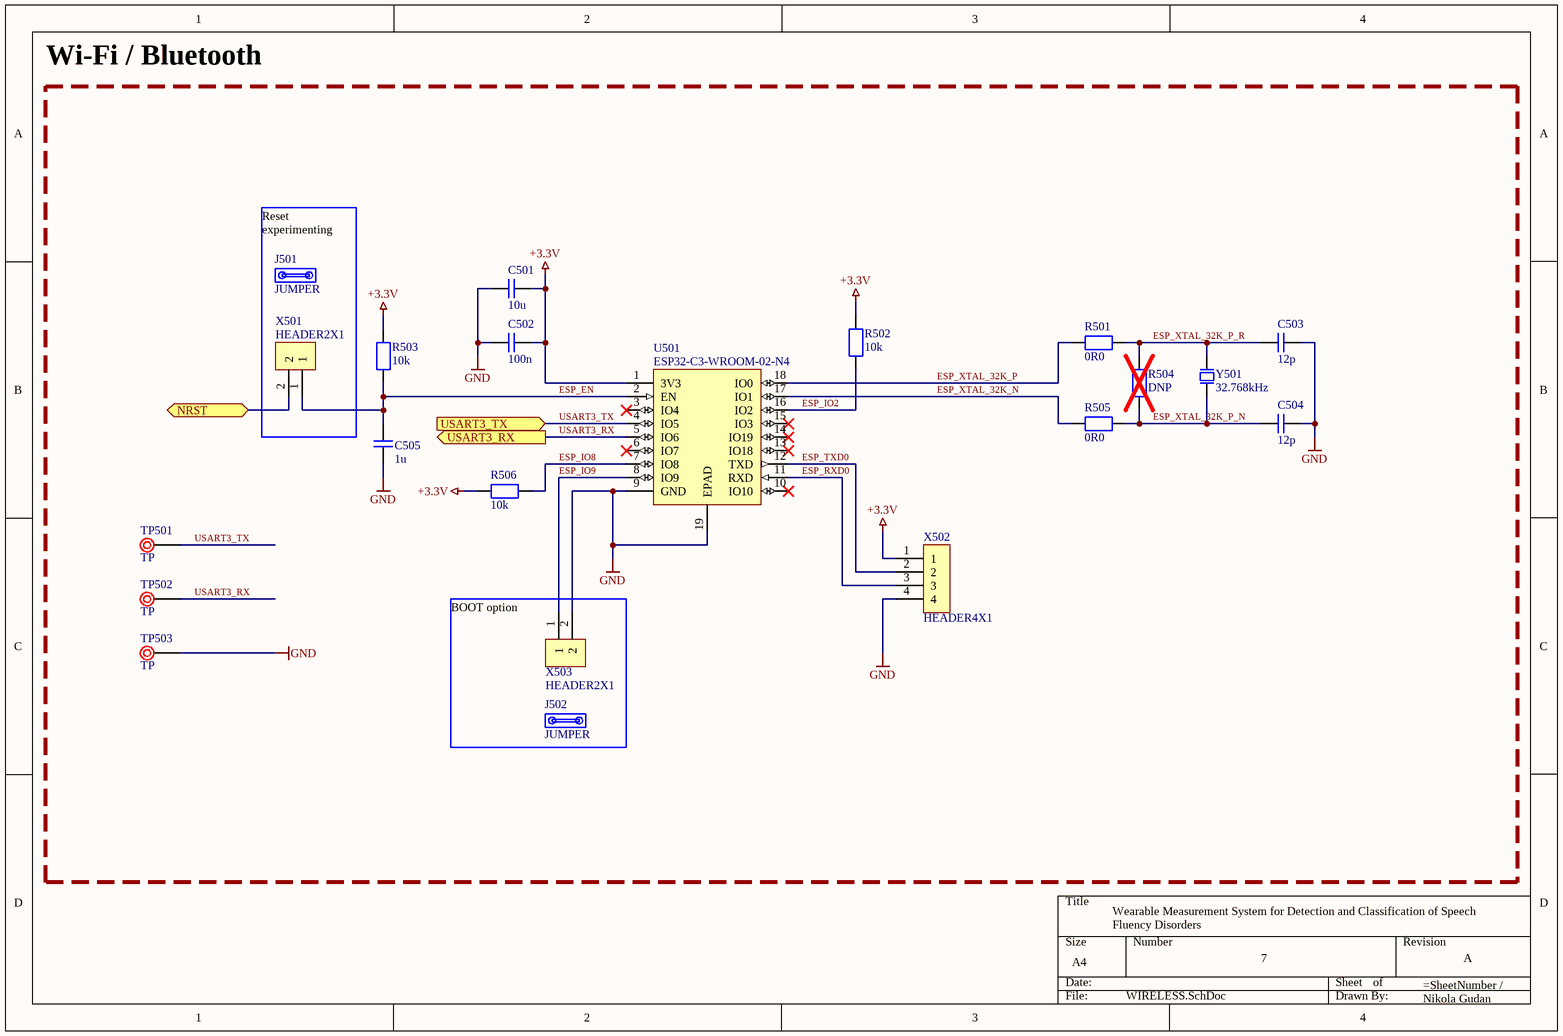
[diagram p6: WIRELESS.SchDoc]

### Parts
C501  10u  [CAPC0603]
C502  100n  [CAPC0603]
C503  12p  [CAPC0603]
C504  12p  [CAPC0603]
C505  1u  [CAPC0603]
J501  JUMPER  (mechanical)
J502  JUMPER  (mechanical)
R501  0R0  [RESC0603]
R502  10k  [RESC0603]
R503  10k  [RESC0603]
R504  DNP  [RESC0603]
R505  0R0  [RESC0603]
R506  10k  [RESC0603]
TP501  TP  [TESTPOINT]
TP502  TP  [TESTPOINT]
TP503  TP  [TESTPOINT]
U501  ESP32-C3-WROOM-02-N4  [ESP32-C3-WROOM-02-N4]
X501  HEADER2X1  [HDRV2W64P254_2X1_508X254X1150]
X502  HEADER4X1  [HDRV4W64P254_4X1_1016X254X1150]
X503  HEADER2X1  [HDRV2W64P254_2X1_508X254X1150]
Y501  32.768kHz  [XTAL320X150X80]

### Blocks framed on the sheet
Wi-Fi / Bluetooth: C501-C505 J501 J502 R501-R506 TP501-TP503 U501 X501-X503 Y501

### Ports
NRST (bidir, see CONN[4A], MCU[2D]), USART3_RX (out, see MCU[1C]), USART3_TX (in, see MCU[1C])

### Nets
+3.3V: C501.1 C502.1 R502.2 R503.2 R506.2 U501.1(3V3) X502.1
GND: C501.2 C502.2 C503.1 C504.1 C505.1 TP503.1 U501.9(GND) U501.19(EPAD) X502.4 X503.2
ESP_EN: C505.2 R503.1 U501.2(EN) X501.1
ESP_IO2: R502.1 U501.16(IO2)
ESP_IO8: R506.1 U501.7(IO8)
ESP_IO9: U501.8(IO9) X503.1
ESP_RXD0: U501.11(RXD) X502.3
ESP_TXD0: U501.12(TXD) X502.2
ESP_XTAL_32K_N: R505.2 U501.17(IO1)
ESP_XTAL_32K_P: R501.2 U501.18(IO0)
ESP_XTAL_32K_P_N: C504.2 R504.2 R505.1 Y501.1
ESP_XTAL_32K_P_R: C503.2 R501.1 R504.1 Y501.2
MCU_NRST: X501.2 ; port NRST
USART3_RX: TP502.1 U501.5(IO6) ; port USART3_RX
USART3_TX: TP501.1 U501.4(IO5) ; port USART3_TX

Not connected (* = marked no-connect by the designer): U501 3(IO4)* 6(IO7)* 10(IO10)* 13(IO18)* 14(IO19)* 15(IO3)*

### Notes on the sheet
- Reset experimenting
- BOOT option

### Library data of the parts
C501-C505 = CAPC0603: as C101 on sheet POWER; MFR: ?; Supplier: Digi-Key; SPN: ?; MFRN: ?; LCSC Part Number: ?
  C501: Value: 10u
  C502: Value: 100n
  C503 C504: Footprint: 0603; Value: 12p
  C505: Value: 1u
J501 J502 = JUMPER: as J101 on sheet POWER; Supplier: Digi-Key; LCSC Part Number: C5305
R501-R506 = RES0603: as R101 on sheet POWER; MFR: ?; Supplier: Digi-Key; SPN: ?; MFRN: ?; LCSC Part Number: ?
  R501 R505: Value: 0R0
  R502 R503 R506: Value: 10k
  R504: Value: DNP
TP501-TP503 = TESTPOINT: as TP101 on sheet POWER; Supplier: Digi-Key; LCSC Part Number: C238122
U501 = ESP32-C3-WROOM-02-N4: RF transceiver module, Bluetooth, WiFi; MFR: Espressif Systems; SPN: 1965-ESP32-C3-WROOM-02-N4TR-ND; Checked: Yes; Supplier: Digi-Key; MFRN: ESP32-C3-WROOM-02-N4; Value: ESP32-C3-WROOM-02-N4; LCSC Part Number: C2934560
X501 X503 = HEADER2X1: as X104 on sheet POWER; Supplier: Digi-Key; Value: HEADER2X1; LCSC Part Number: C2883961
X502 = HEADER4X1: as X402 on sheet CONN; Supplier: Digi-Key; Value: HEADER4X1
Y501 = X1A0001410002: as Y301 on sheet MCU; Footprint: SMD3215-2P; Supplier: Digi-Key; MFRN: X1A0001410002; Value: 32.768kHz; LCSC Part Number: C1987155

## Nets that join several sheets
+3.3V: POWER (6 pins), USB (9 pins), MCU (20 pins), CONN (11 pins), WIRELESS (7 pins)
+VUSB: POWER (C108.2 U102.22), USB (X201.2 X202.1)
GND: POWER (30 pins), USB (18 pins), MCU (31 pins), CONN (14 pins), WIRELESS (10 pins)
0.5_B: POWER (R116.2 R117.1), MCU (U301.34)
B_EN: POWER (Q104.1), MCU (U301.35)
CARD_DETECT: MCU (U301.77), CONN (R408.2 X401.10)
CHG_USB1: POWER (R109.2 R112.1 U102.4), MCU (U301.62)
CHG_USB2: POWER (R110.2 R113.1 U102.3), MCU (U301.61)
CHG_USB3: POWER (R111.2 R114.1 U102.2), MCU (U301.60)
DBG_USART_RX: MCU (U301.25), CONN (X402.2)
DBG_USART_TX: MCU (U301.24), CONN (X402.3)
I2C1_SCL: USB (R208.1 U201.13), MCU (D302.1 R304.1 U301.92 U302.6)
I2C1_SDA: USB (R207.1 U201.12), MCU (D301.1 R303.1 U301.93 U302.5)
I2S2_CK: MCU (U301.52), CONN (TP402.1 X404.3)
I2S2_SD: MCU (U301.54), CONN (TP401.1 X404.1)
MCU_NRST: MCU (C315.2 S301.1 S301.2 U301.14), CONN (X403.5), WIRELESS (X501.2)
SDMMC1_CK: MCU (TP310.1 U301.80), CONN (R406.1)
SDMMC1_CMD: MCU (TP306.1 U301.83), CONN (R401.1 X401.2)
SDMMC1_D0: MCU (TP302.1 U301.65), CONN (R402.1 X401.7)
SDMMC1_D1: MCU (TP305.1 U301.66), CONN (R403.1 X401.8)
SDMMC1_D2: MCU (TP309.1 U301.78), CONN (R404.1 X401.9)
SDMMC1_D3: MCU (TP303.1 U301.79), CONN (R405.1 X401.1)
SWCLK: MCU (U301.76), CONN (X403.2)
SWDIO: MCU (U301.72), CONN (X403.4)
USART3_RX: MCU (U301.47), WIRELESS (TP502.1 U501.5)
USART3_TX: MCU (U301.46), WIRELESS (TP501.1 U501.4)
USB_OTG_FS_N: USB (X204.A7 X204.B7), MCU (U301.70)
USB_OTG_FS_P: USB (X204.A6 X204.B6), MCU (U301.71)
USB_PD_FLIP: USB (R210.1 U201.10), MCU (U301.56)
USB_PD_GPIO_1: USB (U201.8), MCU (U301.57)
USB_PD_~{INT}: USB (R209.1 U201.7), MCU (U301.58)

## Assembly variants
Production: not fitted R109 R111 R113 R203 R204 R214 R215 R407 R504